# Altium project K10P100最小系统V1.0.PrjPCB
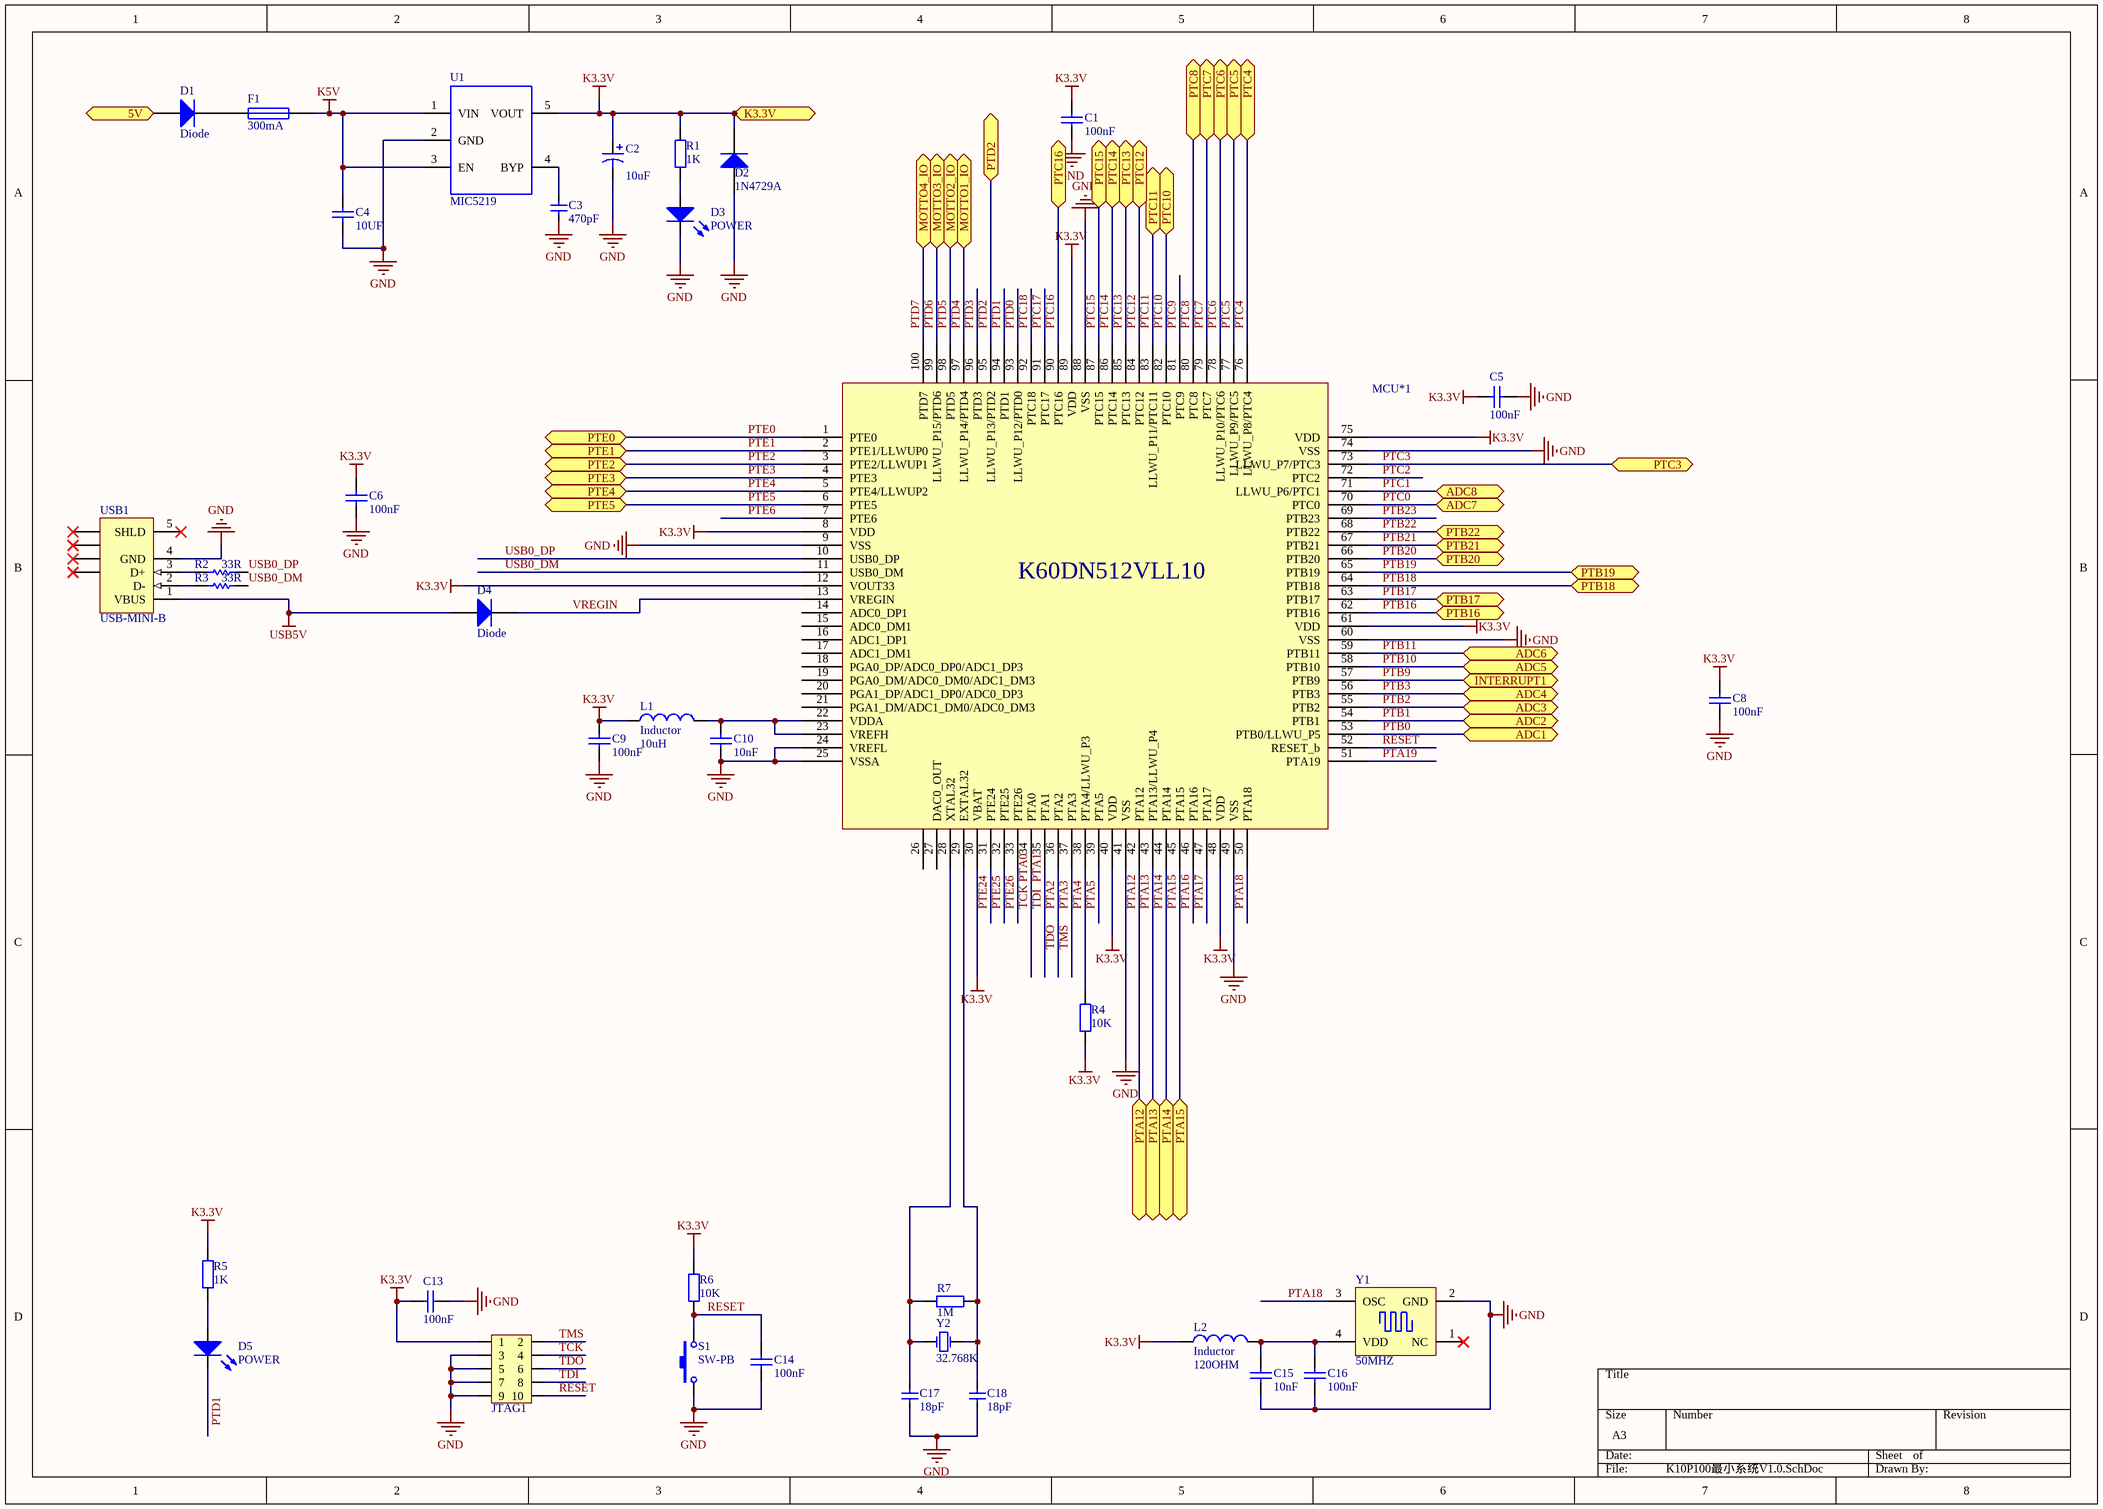
[diagram p0: K10P100最小系统V1.0.SchDoc]
4 sheets, 129 parts. Net scope: flat (ports and power ports of the same name join across sheets).
Board file: K10P100最小系统V1.0.PcbDoc
Sheets:
  K10P100最小系统V1.0.SchDoc
  电机驱动.SchDoc
  其他外设.SchDoc
  电源.SchDoc

## Sheet K10P100最小系统V1.0.SchDoc
size A3

### Parts
C1  100nF  [C2012]
C2  value 10uF  [C2012]  (hidden comment: Cap Pol1)
C3  470pF  [C2012]
C4  10UF  [C2012]
C5  100nF  [C2012]
C6  100nF  [C2012]
C8  100nF  [C2012]
C9  100nF  [C2012]
C10  10nF  [C2012]
C13  100nF  [C2012]
C14  100nF  [C2012]
C15  10nF  [C2012]
C16  100nF  [C2012]
C17  18pF  [C2012]
C18  18pF  [C2012]
D1  Diode  [1206(2)]
D2  1N4729A  [C2012]
D3  POWER  [C2012]
D4  Diode  [1206(2)]
D5  POWER  [C2012]
F1  300mA  [R2012]
JTAG1  Header 5X2  [IDC5X2]  (value not drawn)
L1  Inductor  value 10uH  [C2012]
L2  Inductor  value 120OHM  [C2012]
MCU*1  k60P100  [LQFP100]  (value not drawn)
R1  1K  [R2012]
R2  33R  [R2012]
R3  33R  [R2012]
R4  10K  [R2012]
R5  1K  [R2012]
R6  10K  [R2012]
R7  1M  [R2012]
S1  SW-PB  [sw 3*4 *2]
U1  MIC5219  [SOT-23-5]
USB1  USB-MINI-B  [USB-MINI-B]
Y1  50MHZ  [XTAL7_3225]
Y2  32.768K  [CT3215]

### Ports
5V, ADC1, ADC2, ADC3, ADC4, ADC5, ADC6, ADC7, ADC8, INTERRUPT1, K3.3V, MOTTO1_IO, MOTTO2_IO, MOTTO3_IO, MOTTO4_IO, PTA12, PTA13, PTA14, PTA15, PTB16, PTB17, PTB18, PTB19, PTB20, PTB21, PTB22, PTC3, PTC4, PTC5, PTC6, PTC7, PTC8, PTC10, PTC11, PTC12, PTC13, PTC14, PTC15, PTC16, PTD2, PTE0, PTE1, PTE2, PTE3, PTE4, PTE5

### Nets
5V: D1.1(A) ; port 5V
GND: C1.1 C2.2 C3.1 C4.1 C5.1 C6.1 C8.1 C9.1 C10.1 C13.2 C14.1 C15.1 C16.1 C17.1 C18.1 D2.1(A) D3.2 JTAG1.3 JTAG1.5 JTAG1.7 JTAG1.9 MCU*1.9(VSS) MCU*1.24(VREFL) MCU*1.25(VSSA) MCU*1.41(VSS) MCU*1.49(VSS) MCU*1.60(VSS) MCU*1.74(VSS) MCU*1.88(VSS) S1.1 U1.2(GND) USB1.4(GND) Y1.2(GND)
K3.3V: C1.2 C2.1 C5.2 C6.2 C8.2 C9.2 C13.1 D2.2(K) JTAG1.1 L1.1 L2.1 MCU*1.8(VDD) MCU*1.12(VOUT33) MCU*1.30(VBAT) MCU*1.40(VDD) MCU*1.48(VDD) MCU*1.61(VDD) MCU*1.75(VDD) MCU*1.89(VDD) R1.2 R4.1 R5.2 R6.2 U1.5(VOUT) ; port K3.3V
K5V: C4.2 F1.1 U1.1(VIN) U1.3(EN)
USB5V: D4.1(A) USB1.1(VBUS)
PTA0: JTAG1.4 MCU*1.34(PTA0)  [also labelled TCK]
PTA1: JTAG1.8 MCU*1.35(PTA1)  [also labelled TDI]
PTA2: JTAG1.6 MCU*1.36(PTA2)  [also labelled TDO]
PTA3: JTAG1.2 MCU*1.37(PTA3)  [also labelled TMS]
PTA4: MCU*1.38(PTA4/LLWU_P3) R4.2
PTA5: MCU*1.39(PTA5)
PTA12: MCU*1.42(PTA12) ; port PTA12
PTA13: MCU*1.43(PTA13/LLWU_P4) ; port PTA13
PTA14: MCU*1.44(PTA14) ; port PTA14  [project net BT RXD]
PTA15: MCU*1.45(PTA15) ; port PTA15  [project net BT TXD]
PTA16: MCU*1.46(PTA16)
PTA17: MCU*1.47(PTA17)
PTA18: MCU*1.50(PTA18) Y1.3(OSC)
PTA19: MCU*1.51(PTA19)
PTB0: MCU*1.53(PTB0/LLWU_P5) ; port ADC1
PTB1: MCU*1.54(PTB1) ; port ADC2
PTB2: MCU*1.55(PTB2) ; port ADC3
PTB3: MCU*1.56(PTB3) ; port ADC4
PTB9: MCU*1.57(PTB9) ; port INTERRUPT1
PTB10: MCU*1.58(PTB10) ; port ADC5
PTB11: MCU*1.59(PTB11) ; port ADC6
PTB16: MCU*1.62(PTB16) ; port PTB16  [project net OLEDCLK]
PTB17: MCU*1.63(PTB17) ; port PTB17  [project net OLEDMISO]
PTB18: MCU*1.64(PTB18) ; port PTB18
PTB19: MCU*1.65(PTB19) ; port PTB19
PTB20: MCU*1.66(PTB20) ; port PTB20  [project net OLEDRST]
PTB21: MCU*1.67(PTB21) ; port PTB21  [project net OLEDDC]
PTB22: MCU*1.68(PTB22) ; port PTB22  [project net OLEDCS]
PTB23: MCU*1.69(PTB23)
PTC0: MCU*1.70(PTC0) ; port ADC7
PTC1: MCU*1.71(LLWU_P6/PTC1) ; port ADC8
PTC2: MCU*1.72(PTC2)
PTC3: MCU*1.73(LLWU_P7/PTC3) ; port PTC3  [project net CE]
PTC4: MCU*1.76(LLWU_P8/PTC4) ; port PTC4  [project net PCS0]
PTC5: MCU*1.77(LLWU_P9/PTC5) ; port PTC5
PTC6: MCU*1.78(LLWU_P10/PTC6) ; port PTC6  [project net MOSI]
PTC7: MCU*1.79(PTC7) ; port PTC7  [project net MISO]
PTC8: MCU*1.80(PTC8) ; port PTC8  [project net IRQ]
PTC9: MCU*1.81(PTC9)
PTC10: MCU*1.82(PTC10) ; port PTC10
PTC11: MCU*1.83(LLWU_P11/PTC11) ; port PTC11
PTC12: MCU*1.84(PTC12) ; port PTC12  [project net Key5]
PTC13: MCU*1.85(PTC13) ; port PTC13  [project net Key4]
PTC14: MCU*1.86(PTC14) ; port PTC14  [project net Key3]
PTC15: MCU*1.87(PTC15) ; port PTC15  [project net Key2]
PTC16: MCU*1.90(PTC16) ; port PTC16  [project net Key1]
PTC17: MCU*1.91(PTC17)
PTC18: MCU*1.92(PTC18)
PTD0: MCU*1.93(LLWU_P12/PTD0)
PTD1: D5.2 MCU*1.94(PTD1)
PTD2: MCU*1.95(LLWU_P13/PTD2) ; port PTD2
PTD3: MCU*1.96(PTD3)
PTD4: MCU*1.97(LLWU_P14/PTD4) ; port MOTTO1_IO
PTD5: MCU*1.98(PTD5) ; port MOTTO2_IO
PTD6: MCU*1.99(LLWU_P15/PTD6) ; port MOTTO3_IO
PTD7: MCU*1.100(PTD7) ; port MOTTO4_IO
PTE0: MCU*1.1(PTE0) ; port PTE0
PTE1: MCU*1.2(PTE1/LLWUP0) ; port PTE1
PTE2: MCU*1.3(PTE2/LLWUP1) ; port PTE2
PTE3: MCU*1.4(PTE3) ; port PTE3
PTE4: MCU*1.5(PTE4/LLWUP2) ; port PTE4
PTE5: MCU*1.6(PTE5) ; port PTE5
PTE6: MCU*1.7(PTE6)
PTE24: MCU*1.31(PTE24)
PTE25: MCU*1.32(PTE25)
PTE26: MCU*1.33(PTE26)
RESET: C14.2 JTAG1.10 MCU*1.52(RESET_b) R6.1 S1.2
USB0_DM: MCU*1.11(USB0_DM) R3.2
USB0_DP: MCU*1.10(USB0_DP) R2.2
VREGIN: D4.2(K) MCU*1.13(VREGIN)
NetC3_2: C3.2 U1.4(BYP)
NetC10_2: C10.2 L1.2 MCU*1.22(VDDA) MCU*1.23(VREFH)
NetC15_2: C15.2 C16.2 L2.2 Y1.4(VDD)
NetC17_2: C17.2 MCU*1.28(XTAL32) R7.1 Y2.1(OSC1)
NetC18_2: C18.2 MCU*1.29(EXTAL32) R7.2 Y2.2(OSC2)
NetD1_2: D1.2(K) F1.2
NetD3_1: D3.1 R1.1
NetD5_1: D5.1 R5.1
NetR2_1: R2.1 USB1.3(D+)
NetR3_1: R3.1 USB1.2(D-)

Not connected (* = marked no-connect by the designer): MCU*1 14(ADC0_DP1) 15(ADC0_DM1) 16(ADC1_DP1) 17(ADC1_DM1) 18(PGA0_DP/ADC0_DP0/ADC1_DP3) 19(PGA0_DM/ADC0_DM0/ADC1_DM3) 20(PGA1_DP/ADC1_DP0/ADC0_DP3) 21(PGA1_DM/ADC1_DM0/ADC0_DM3) 26(VREF_OUT/CMP1_IN5CMP0_IN5/ADC1_SE18) 27(DAC0_OUT); USB1 5(SHLD)* 6(SHLD)* 7(SHLD)* 8(SHLD)* 9(SHLD)*; Y1 1(NC)*

### Notes on the sheet
- (in symbol k60P100) K60DN512VLL10

### Library data of the parts
C1 C4-C6 C8-C10 C13-C16 = Cap: Capacitor
C2 = Cap Pol1: Polarized Capacitor (Radial); Published: 8-Jun-2000; LatestRevisionDate: 17-Jul-2002; LatestRevisionNote: Re-released for DXP Platform.; PackageReference: RB7.6-15; Publisher: Altium Limited; PackageDescription: Polarized Capacitor (Radial); 2 Leads
C3 C17 C18 = 陶瓷电容: CAP
D1 D4 = Diode: Default Diode; Published: 8-Jun-2000; LatestRevisionDate: 17-Jul-2002; LatestRevisionNote: Re-released for DXP Platform.; PackageVersion: Sep-1996; PackageReference: SMC; Publisher: Altium Limited; PackageDescription: DO-214-AB/SMC; 2 C-Bend Leads; Body 7.9 x 5.9 mm, inc. leads (LxW); Code_JEDEC: DO-214-AB
D2 = Diode 1N4148: High Conductance Fast Diode; LatestRevisionDate: 17-Jul-2002; LatestRevisionNote: Re-released for DXP Platform.; DatasheetDocument: 1997; PackageReference: DO-35; Publisher: Altium Limited; Code_JEDEC: DO-204-AH; ComponentLink1Description: Manufacturer Link; ComponentLink2Description: Datasheet; ComponentLink2URL: http://www.fairchildsemi.com/ds/1N%2F1N4148.pdf
D3 D5 = LED: Typical INFRARED GaAs LED
F1 = Fuse 1: Fuse; Published: 8-Jun-2000; LatestRevisionDate: 17-Jul-2002; LatestRevisionNote: Re-released for DXP Platform.; PackageReference: PIN-W2/E2.8; Publisher: Altium Limited
JTAG1 = Header 5X2: Header, 5-Pin, Dual row
L1 L2 = Inductor: Code_IEC: 1005; Published: 8-Jun-2000; LatestRevisionDate: 29-May-2009; LatestRevisionNote: IPC-7351 Footprint Added.; PackageReference: 0402-A; Publisher: Altium Limited; PackageDescription: Chip Inductor; Code_JEITA: 0402
R1 R4 R5 = Res: Resistor of led
R2 R3 = Res: 贴片电阻; Value: 1K; Published: 8-Jun-2000; LatestRevisionDate: 17-Jul-2002; LatestRevisionNote: Re-released for DXP Platform.; PackageReference: AXIAL-0.3; Publisher: Altium Limited
R6 R7 = Res: Resistor
S1 = SW-PB: Switch
U1 = MIC5219: LDO
USB1 = USB-MINI-B: USB 2.0, Right Angle, SMT, A Type, Receptacle, 5 Position, Black; ContactMaterial: Phosphor Bronze; ContactPlating: Gold (30) over Nickel; PCB_Layout: Complies with manufacturer's recommendation.; DrillSize: Corresponds to nominal value.; PanelGround: Without; Published: 15-Jul-2004; DatasheetDocument: 15-Nov-2002; PackageDocument: 15-Nov-2002; PackageReference: 440478; Publisher: Altium Limited; HousingMaterial: Thermoplastic; ComponentLink1Description: Manufacturer Link; ComponentLink1URL: http://www.tycoelectronics.com/; ComponentLink2Description: Packaging Specification; ComponentLink2URL: http://ecommas.tycoelectronics.com/commerce/DocumentDelivery/DDEController?Action=showdoc&DocId=Customer+Drawing%7F440478%7FB%7Fpdf%7FEnglish%7FC_440478_B.pdf
Y1 = XTAL1
Y2 = XTAL: Crystal Oscillator

## Sheet 电机驱动.SchDoc
size A3
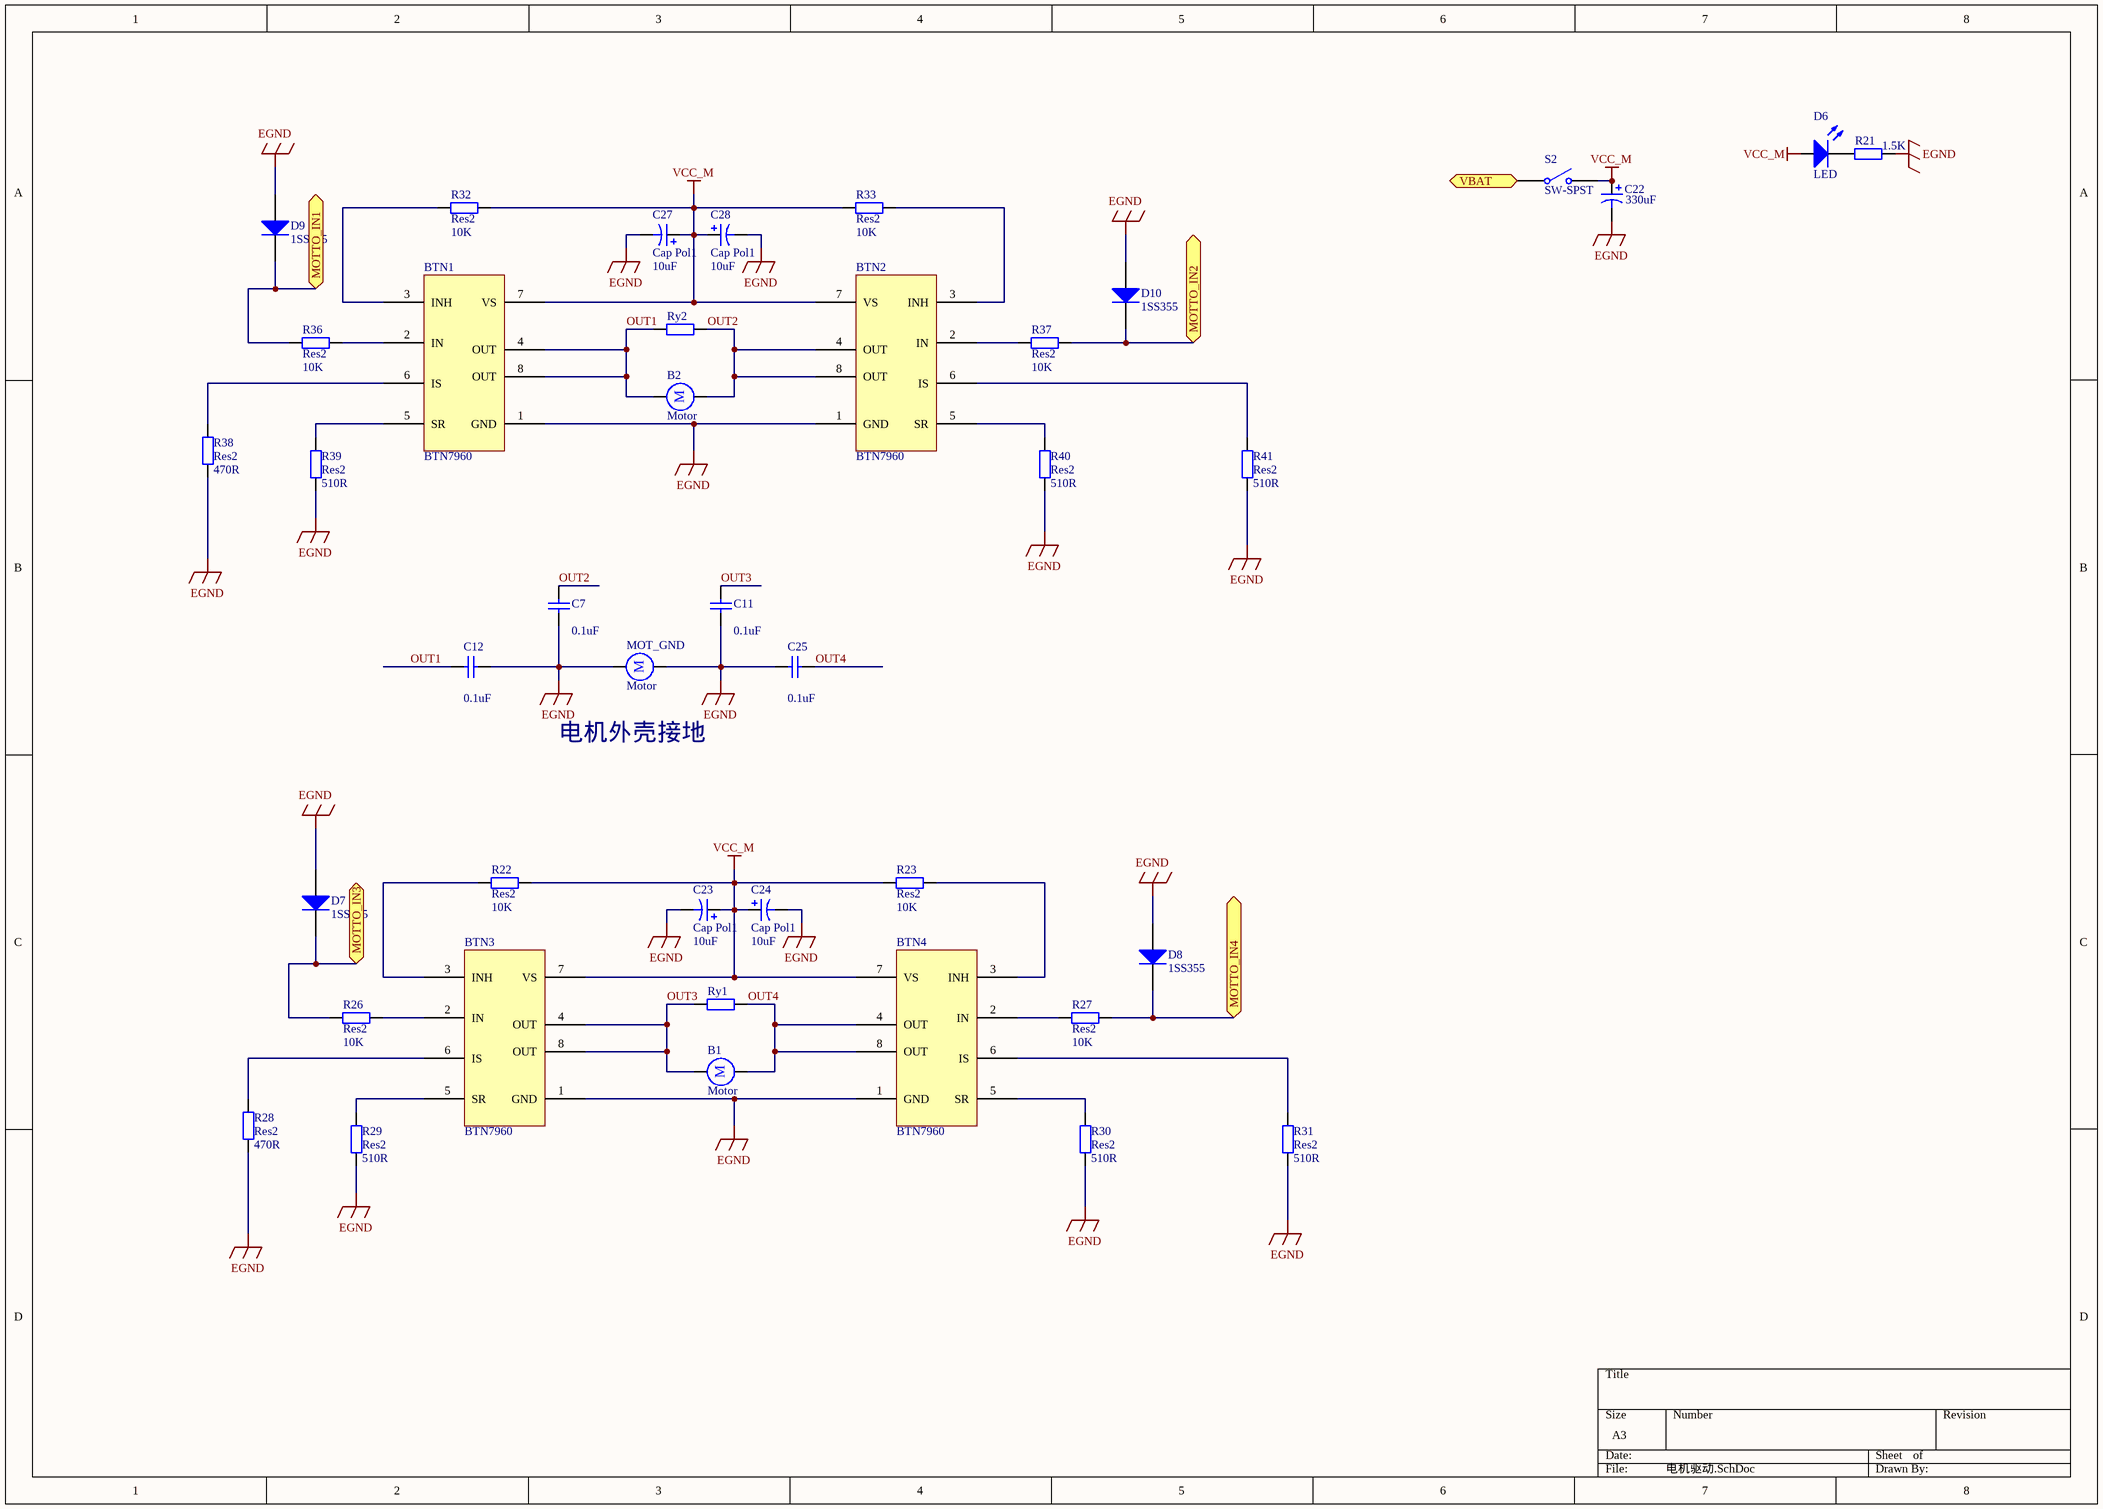
[diagram p1: 电机驱动.SchDoc]

### Parts
B1  Motor  [KF301-2P]
B2  Motor  [KF301-2P]
BTN1  BTN7960  [PG-TO263-7-1]
BTN2  BTN7960  [PG-TO263-7-1]
BTN3  BTN7960  [PG-TO263-7-1]
BTN4  BTN7960  [PG-TO263-7-1]
C7  value 0.1uF  [C2012]  (hidden comment: Cap)
C11  value 0.1uF  [C2012]  (hidden comment: Cap)
C12  value 0.1uF  [C2012]  (hidden comment: Cap)
C22  value 330uF  [SMD-EC-F8]  (hidden comment: Cap Pol1)
C23  Cap Pol1  value 10uF  [1206(2)]
C24  Cap Pol1  value 10uF  [1206(2)]
C25  value 0.1uF  [C2012]  (hidden comment: Cap)
C27  Cap Pol1  value 10uF  [1206(2)]
C28  Cap Pol1  value 10uF  [1206(2)]
D6  LED  [C2012]
D7  1SS355  [1206(2)]
D8  1SS355  [1206(2)]
D9  1SS355  [1206(2)]
D10  1SS355  [1206(2)]
MOT_GND  Motor  [KF301-2P]
R21  value 1.5K  [R2012]  (hidden comment: Res2)
R22  Res2  value 10K  [R2012]
R23  Res2  value 10K  [R2012]
R26  Res2  value 10K  [R2012]
R27  Res2  value 10K  [R2012]
R28  Res2  value 470R  [R2012]
R29  Res2  value 510R  [R2012]
R30  Res2  value 510R  [R2012]
R31  Res2  value 510R  [R2012]
R32  Res2  value 10K  [R2012]
R33  Res2  value 10K  [R2012]
R36  Res2  value 10K  [R2012]
R37  Res2  value 10K  [R2012]
R38  Res2  value 470R  [R2012]
R39  Res2  value 510R  [R2012]
R40  Res2  value 510R  [R2012]
R41  Res2  value 510R  [R2012]
Ry1  (no value)  [1206(2)]
Ry2  (no value)  [1206(2)]
S2  SW-SPST  [SW-125V6A(-)]

### Ports
MOTTO_IN1, MOTTO_IN2, MOTTO_IN3, MOTTO_IN4, VBAT

### Nets
EGND: BTN1.1(GND) BTN2.1(GND) BTN3.1(GND) BTN4.1(GND) C7.2 C11.2 C12.2 C22.2 C23.2 C24.2 C25.1 C27.2 C28.2 D7.1(A) D8.1(A) D9.1(A) D10.1(A) MOT_GND.1 MOT_GND.2 R21.1 R28.1 R29.1 R30.1 R31.1 R38.1 R39.1 R40.1 R41.1
VBAT: S2.1(COMMON) ; port VBAT
VCC_M: BTN1.7(VS) BTN2.7(VS) BTN3.7(VS) BTN4.7(VS) C22.1 C23.1 C24.1 C27.1 C28.1 D6.1 R22.2 R23.1 R32.2 R33.1 S2.2(NO)
OUT1: B2.1 BTN1.4(OUT) BTN1.8(OUT) C12.1 Ry2.1
OUT2: B2.2 BTN2.4(OUT) BTN2.8(OUT) C7.1 Ry2.2
OUT3: B1.1 BTN3.4(OUT) BTN3.8(OUT) C11.1 Ry1.1
OUT4: B1.2 BTN4.4(OUT) BTN4.8(OUT) C25.2 Ry1.2
NetBTN1_2: BTN1.2(IN) R36.2
NetBTN1_3: BTN1.3(INH) R32.1
NetBTN1_5: BTN1.5(SR) R39.2
NetBTN1_6: BTN1.6(IS) R38.2
NetBTN2_2: BTN2.2(IN) R37.1
NetBTN2_3: BTN2.3(INH) R33.2
NetBTN2_5: BTN2.5(SR) R40.2
NetBTN2_6: BTN2.6(IS) R41.2
NetBTN3_2: BTN3.2(IN) R26.2
NetBTN3_3: BTN3.3(INH) R22.1
NetBTN3_5: BTN3.5(SR) R29.2
NetBTN3_6: BTN3.6(IS) R28.2
NetBTN4_2: BTN4.2(IN) R27.1
NetBTN4_3: BTN4.3(INH) R23.2
NetBTN4_5: BTN4.5(SR) R30.2
NetBTN4_6: BTN4.6(IS) R31.2
NetD6_2: D6.2 R21.2
NetD7_2: D7.2(K) R26.1 ; port MOTTO_IN3
NetD8_2: D8.2(K) R27.2 ; port MOTTO_IN4
NetD9_2: D9.2(K) R36.1 ; port MOTTO_IN1
NetD10_2: D10.2(K) R37.2 ; port MOTTO_IN2

### Notes on the sheet
- 电机外壳接地
- (in symbol Motor) M

### Library data of the parts
B1 B2 MOT_GND = Motor: Motor, General Kind
C7 C11 C12 C25 = Cap: Capacitor; Published: 8-Jun-2000; LatestRevisionDate: 17-Jul-2002; LatestRevisionNote: Re-released for DXP Platform.; PackageReference: RAD-0.3; Publisher: Altium Limited; PackageDescription: Radial Cap, Thru-Hole; 2 Leads; 0.3 in Pin Spacing
C22-C24 C27 C28 = Cap Pol1: Polarized Capacitor (Radial); Published: 8-Jun-2000; LatestRevisionDate: 17-Jul-2002; LatestRevisionNote: Re-released for DXP Platform.; PackageReference: RB7.6-15; Publisher: Altium Limited; PackageDescription: Polarized Capacitor (Radial); 2 Leads
D6 = LED: Typical INFRARED GaAs LED
D7-D10 = Diode 1N4148: High Conductance Fast Diode; LatestRevisionDate: 17-Jul-2002; LatestRevisionNote: Re-released for DXP Platform.; DatasheetDocument: 1997; PackageReference: DO-35; Publisher: Altium Limited; Code_JEDEC: DO-204-AH; ComponentLink1Description: Manufacturer Link; ComponentLink2Description: Datasheet; ComponentLink2URL: http://www.fairchildsemi.com/ds/1N%2F1N4148.pdf
R21-R23 R26-R33 R36-R41 = Res2: Resistor; Published: 8-Jun-2000; LatestRevisionDate: 17-Jul-2002; LatestRevisionNote: Re-released for DXP Platform.; PackageReference: AXIAL-0.4; Publisher: Altium Limited; PackageDescription: Axial Device, Thru-Hole; 2 Leads; 0.4 in Pin Spacing
Ry1 Ry2 = Res: Resistor
S2 = SW-SPST: Single-Pole, Single-Throw Switch; Published: 24-Mar-1999; LatestRevisionDate: 17-Jul-2002; LatestRevisionNote: Re-released for DXP Platform.; PackageReference: SPST-2; Publisher: Altium Limited; PackageDescription: Switch; 2 Leads

## Sheet 其他外设.SchDoc
size A3
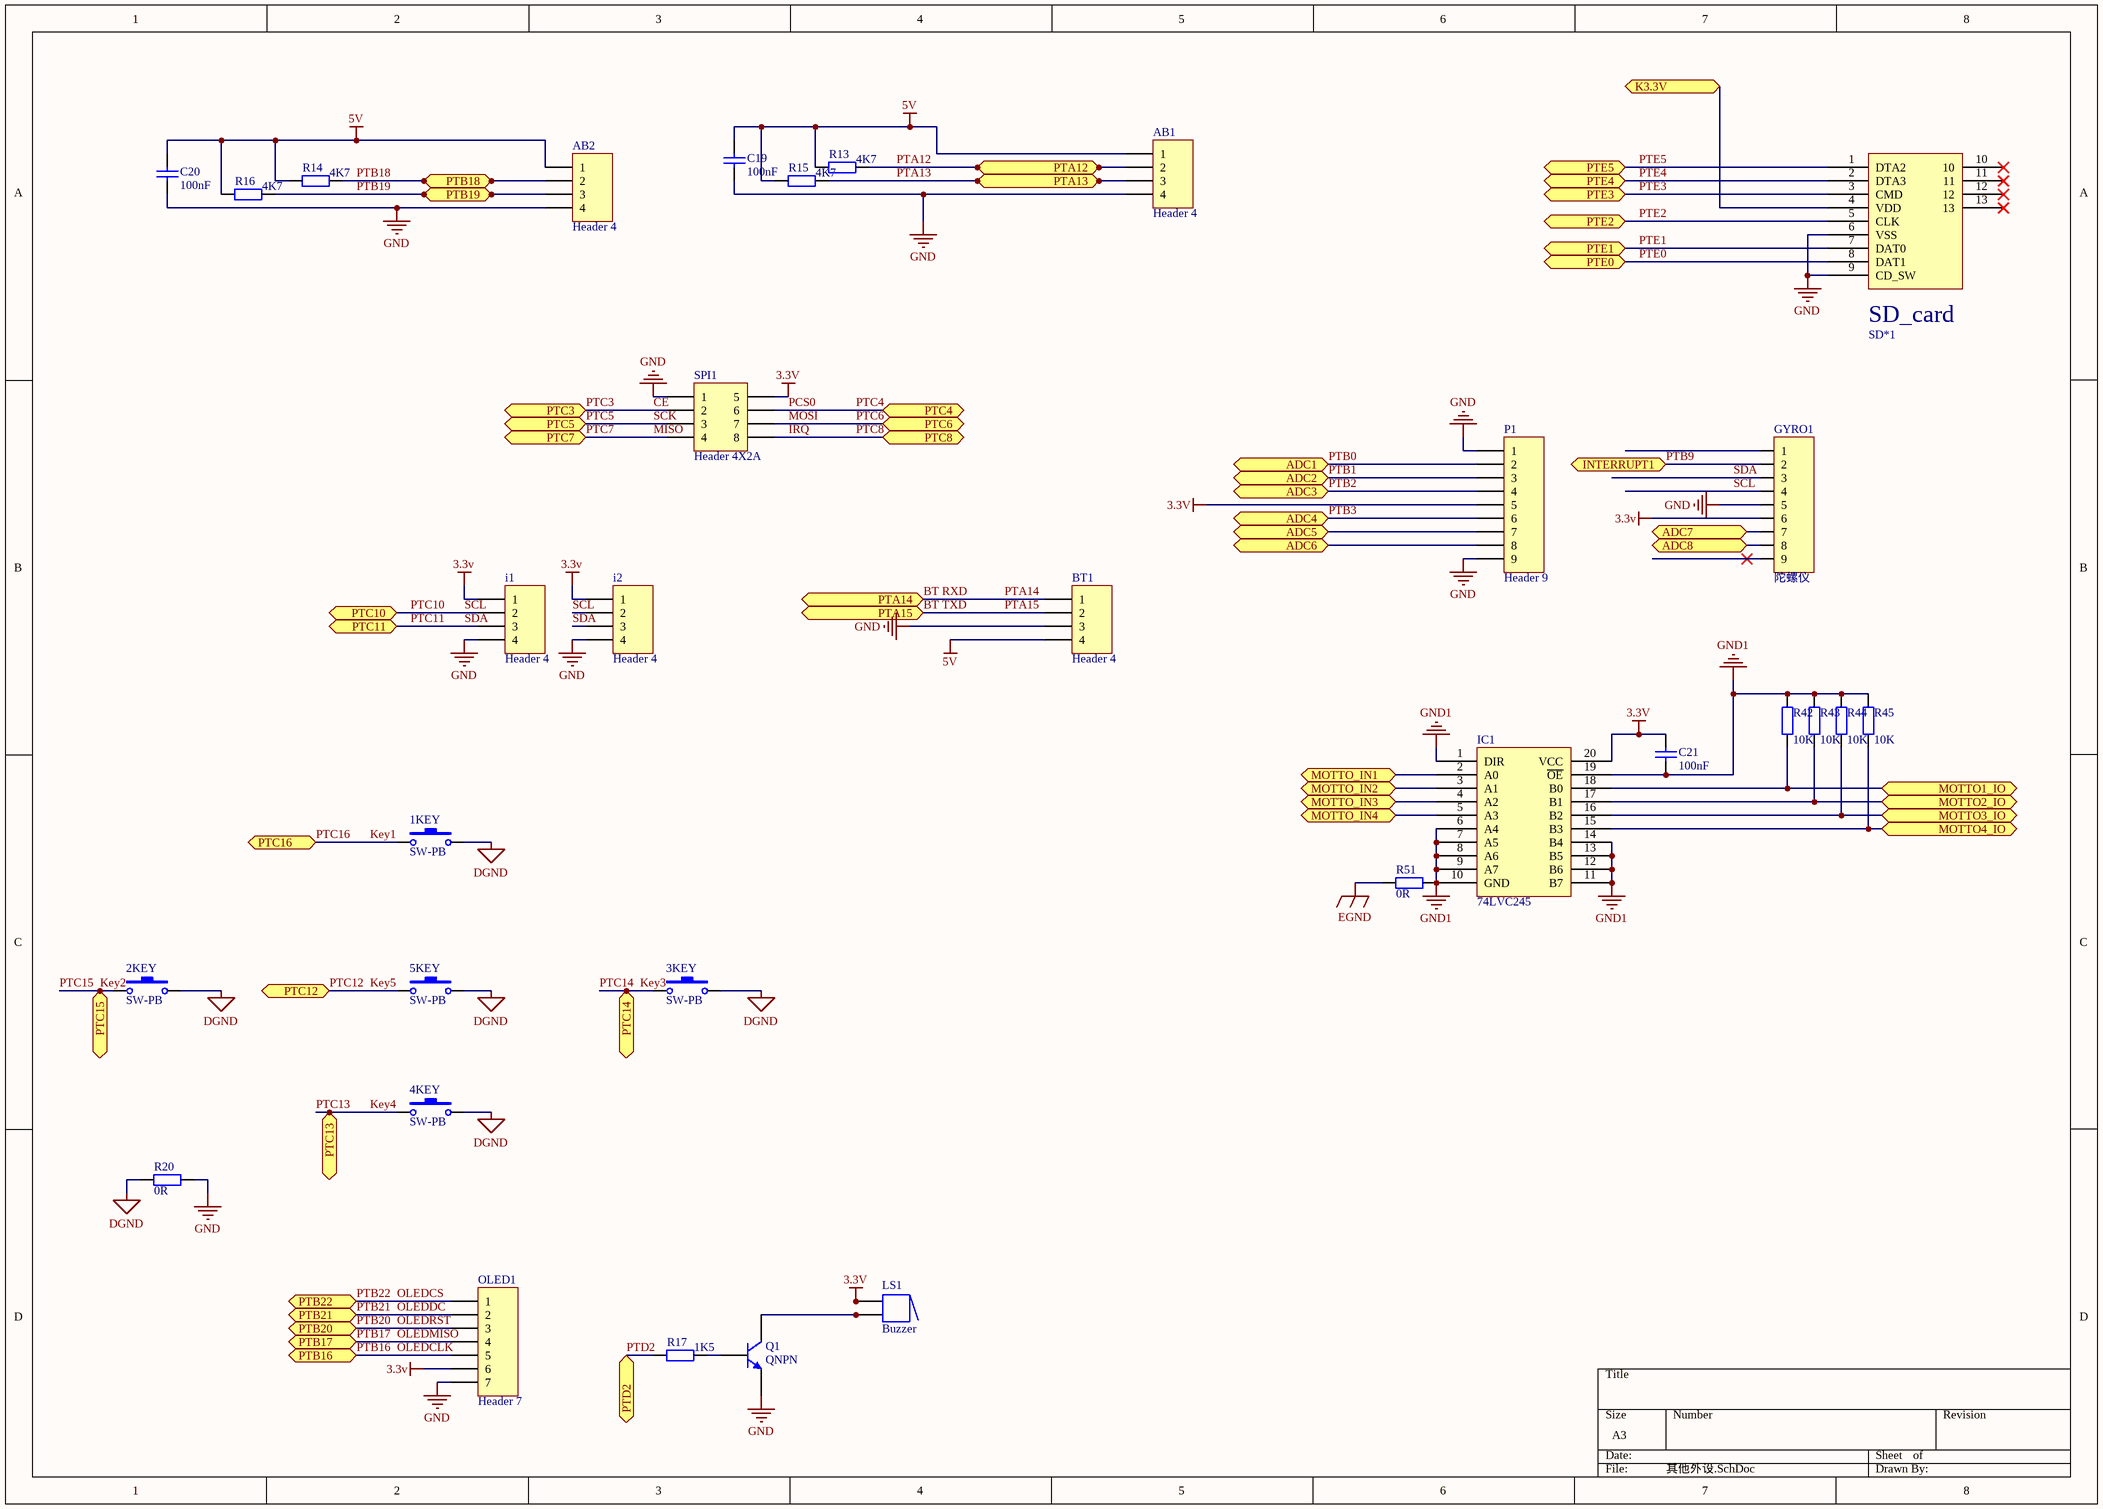
[diagram p2: 其他外设.SchDoc]

### Parts
1KEY  SW-PB  [sw 3*4 *2]
2KEY  SW-PB  [sw 3*4 *2]
3KEY  SW-PB  [sw 3*4 *2]
4KEY  SW-PB  [sw 3*4 *2]
5KEY  SW-PB  [sw 3*4 *2]
AB1  Header 4  [HDR1X4]
AB2  Header 4  [HDR1X4]
BT1  Header 4  [HDR1X4]
C19  100nF  [C2012]
C20  100nF  [C2012]
C21  100nF  [C2012]
GYRO1  陀螺仪  [landzo_AngularRate_Accelerometer_Sensor]
i1  Header 4  [HDR1X4]
i2  Header 4  [HDR1X4]
IC1  74LVC245  [TSSOP20 74lvc245]
LS1  Buzzer  [ABSM-1574]
OLED1  Header 7  [HDR1X7]
P1  Header 9  [HDR1X9]
Q1  QNPN  [SOT95P240-3N]
R13  value 4K7  [R2012]  (hidden comment: Res2)
R14  value 4K7  [R2012]  (hidden comment: Res2)
R15  value 4K7  [R2012]  (hidden comment: Res2)
R16  value 4K7  [R2012]  (hidden comment: Res2)
R17  value 1K5  [R2012]  (hidden comment: Res2)
R20  0R  [R2012]
R42  value 10K  [R2012]  (hidden comment: Res2)
R43  value 10K  [R2012]  (hidden comment: Res2)
R44  value 10K  [R2012]  (hidden comment: Res2)
R45  value 10K  [R2012]  (hidden comment: Res2)
R51  value 0R  [1206(2)]  (hidden comment: Res2)
SD*1  TF_card  [SD_card]  (value not drawn)
SPI1  Header 4X2A  [SMT head4*1]

### Ports
ADC1, ADC2, ADC3, ADC4, ADC5, ADC6, ADC7, ADC8, INTERRUPT1, K3.3V, MOTTO1_IO, MOTTO2_IO, MOTTO3_IO, MOTTO4_IO, MOTTO_IN1, MOTTO_IN2, MOTTO_IN3, MOTTO_IN4, PTA12, PTA13, PTA14, PTA15, PTB16, PTB17, PTB18, PTB19, PTB20, PTB21, PTB22, PTC3, PTC4, PTC5, PTC6, PTC7, PTC8, PTC10, PTC11, PTC12, PTC13, PTC14, PTC15, PTC16, PTD2, PTE0, PTE1, PTE2, PTE3, PTE4, PTE5

### Nets
3.3v: C21.1 GYRO1.6 i1.1 i2.1 IC1.20(VCC) LS1.1 LS1.1A OLED1.6 P1.5 SPI1.5
5V: AB1.1 AB2.1 BT1.4 C19.1 C20.1 R13.2 R14.2 R15.2 R16.2
DGND: 1KEY.2 2KEY.2 3KEY.2 4KEY.2 5KEY.2 R20.2
EGND: R51.1
GND: AB1.4 AB2.4 BT1.3 C19.2 C20.2 GYRO1.5 i1.4 i2.4 OLED1.7 P1.1 P1.9 Q1.3(E) R20.1 SD*1.6(VSS) SD*1.9(CD_SW) SPI1.1
GND1: C21.2 IC1.1(DIR) IC1.6(A4) IC1.7(A5) IC1.8(A6) IC1.9(A7) IC1.10(GND) IC1.11(B7) IC1.12(B6) IC1.13(B5) IC1.14(B4) IC1.19(~{OE}) R42.2 R43.2 R44.2 R45.2 R51.2
K3.3V: SD*1.4(VDD) ; port K3.3V
BT RXD: BT1.1 ; port PTA14  [also labelled PTA14]
BT TXD: BT1.2 ; port PTA15  [also labelled PTA15]
CE: SPI1.2 ; port PTC3  [also labelled PTC3]
IRQ: SPI1.8 ; port PTC8  [also labelled PTC8]
Key1: 1KEY.1 ; port PTC16  [also labelled PTC16]
Key2: 2KEY.1 ; port PTC15  [also labelled PTC15]
Key3: 3KEY.1 ; port PTC14  [also labelled PTC14]
Key4: 4KEY.1 ; port PTC13  [also labelled PTC13]
Key5: 5KEY.1 ; port PTC12  [also labelled PTC12]
MISO: SPI1.4 ; port PTC7  [also labelled PTC7]
MOSI: SPI1.7 ; port PTC6  [also labelled PTC6]
OLEDCLK: OLED1.5 ; port PTB16  [also labelled PTB16]
OLEDCS: OLED1.1 ; port PTB22  [also labelled PTB22]
OLEDDC: OLED1.2 ; port PTB21  [also labelled PTB21]
OLEDMISO: OLED1.4 ; port PTB17  [also labelled PTB17]
OLEDRST: OLED1.3 ; port PTB20  [also labelled PTB20]
PCS0: SPI1.6 ; port PTC4  [also labelled PTC4]
PTA12: AB1.2 R13.1 ; port PTA12
PTA13: AB1.3 R15.1 ; port PTA13
PTB0: P1.2 ; port ADC1
PTB1: P1.3 ; port ADC2
PTB2: P1.4 ; port ADC3
PTB3: P1.6 ; port ADC4
PTB9: GYRO1.2 ; port INTERRUPT1
PTB10: P1.7 ; port ADC5
PTB11: P1.8 ; port ADC6
PTB18: AB2.2 R14.1 ; port PTB18
PTB19: AB2.3 R16.1 ; port PTB19
PTC0: GYRO1.7 ; port ADC7
PTC1: GYRO1.8 ; port ADC8
PTC5: SPI1.3 ; port PTC5  [also labelled SCK]
PTC10: GYRO1.4 i1.2 i2.2 ; port PTC10  [also labelled SCL]
PTC11: GYRO1.3 i1.3 i2.3 ; port PTC11  [also labelled SDA]
PTD2: R17.2 ; port PTD2
PTD4: IC1.18(B0) R42.1 ; port MOTTO1_IO
PTD5: IC1.17(B1) R43.1 ; port MOTTO2_IO
PTD6: IC1.16(B2) R44.1 ; port MOTTO3_IO
PTD7: IC1.15(B3) R45.1 ; port MOTTO4_IO
PTE0: SD*1.8(DAT1) ; port PTE0
PTE1: SD*1.7(DAT0) ; port PTE1
PTE2: SD*1.5(CLK) ; port PTE2
PTE3: SD*1.3(CMD) ; port PTE3
PTE4: SD*1.2(DTA3) ; port PTE4
PTE5: SD*1.1(DTA2) ; port PTE5
NetD7_2: IC1.4(A2) ; port MOTTO_IN3
NetD8_2: IC1.5(A3) ; port MOTTO_IN4
NetD9_2: IC1.2(A0) ; port MOTTO_IN1
NetD10_2: IC1.3(A1) ; port MOTTO_IN2
NetLS1_2: LS1.2 LS1.2A Q1.1(C)
NetQ1_2: Q1.2(B) R17.1

Not connected (* = marked no-connect by the designer): GYRO1 1 9*; SD*1 10* 11* 12* 13*

### Notes on the sheet
- (in symbol TF_card) SD_card

### Library data of the parts
1KEY 2KEY 3KEY 4KEY 5KEY = SW-PB: Switch
AB1 AB2 BT1 i1 i2 = Header 4: Header, 4-Pin; LatestRevisionDate: 17-Jul-2002; LatestRevisionNote: Re-released for DXP Platform.; Publisher: Altium Limited
C19-C21 = Cap: Capacitor
GYRO1 = Header 9: Header, 8-Pin
LS1 = Buzzer: Magnetic Transducer Buzzer; pin to pad: 1>1A 2>2A; Published: 24-Mar-1999; LatestRevisionDate: 17-Dec-2003; LatestRevisionNote: Schematic revised, PCB Footprint replaced.; DatasheetVersion: 17-Dec-2003; PackageReference: ABSM-1574; Publisher: Altium Limited; ComponentLink1Description: Manufacturer Link; ComponentLink1URL: http://www.megastar.com/linecard/buzzmode/index.php
OLED1 = Header 7: Header, 7-Pin; LatestRevisionDate: 17-Jul-2002; LatestRevisionNote: Re-released for DXP Platform.; Publisher: Altium Limited
P1 = Header 9: Header, 9-Pin; LatestRevisionDate: 17-Jul-2002; LatestRevisionNote: Re-released for DXP Platform.; Publisher: Altium Limited
Q1 = QNPN: NPN Bipolar Transistor; pin to pad: 1>3 2>1 3>2; Published: 8-Jun-2000; LatestRevisionDate: 29-May-2009; LatestRevisionNote: IPC-7351 Footprint Added.; PackageVersion: Aug-1999; PackageReference: SOT-23B; Publisher: Altium Limited; PackageDescription: 3-Pin SOT-23 Package 0.95 mm Pitch, 2.4 mm Lead Span
R13-R17 R42-R45 R51 = Res2: Resistor; Published: 8-Jun-2000; LatestRevisionDate: 17-Jul-2002; LatestRevisionNote: Re-released for DXP Platform.; PackageReference: AXIAL-0.4; Publisher: Altium Limited; PackageDescription: Axial Device, Thru-Hole; 2 Leads; 0.4 in Pin Spacing
R20 = Res: Resistor of led
SPI1 = Header 4X2A: Header, 4-Pin, Dual row; LatestRevisionDate: 17-Jul-2002; LatestRevisionNote: Re-released for DXP Platform.; Publisher: Altium Limited

## Sheet 电源.SchDoc
size A3
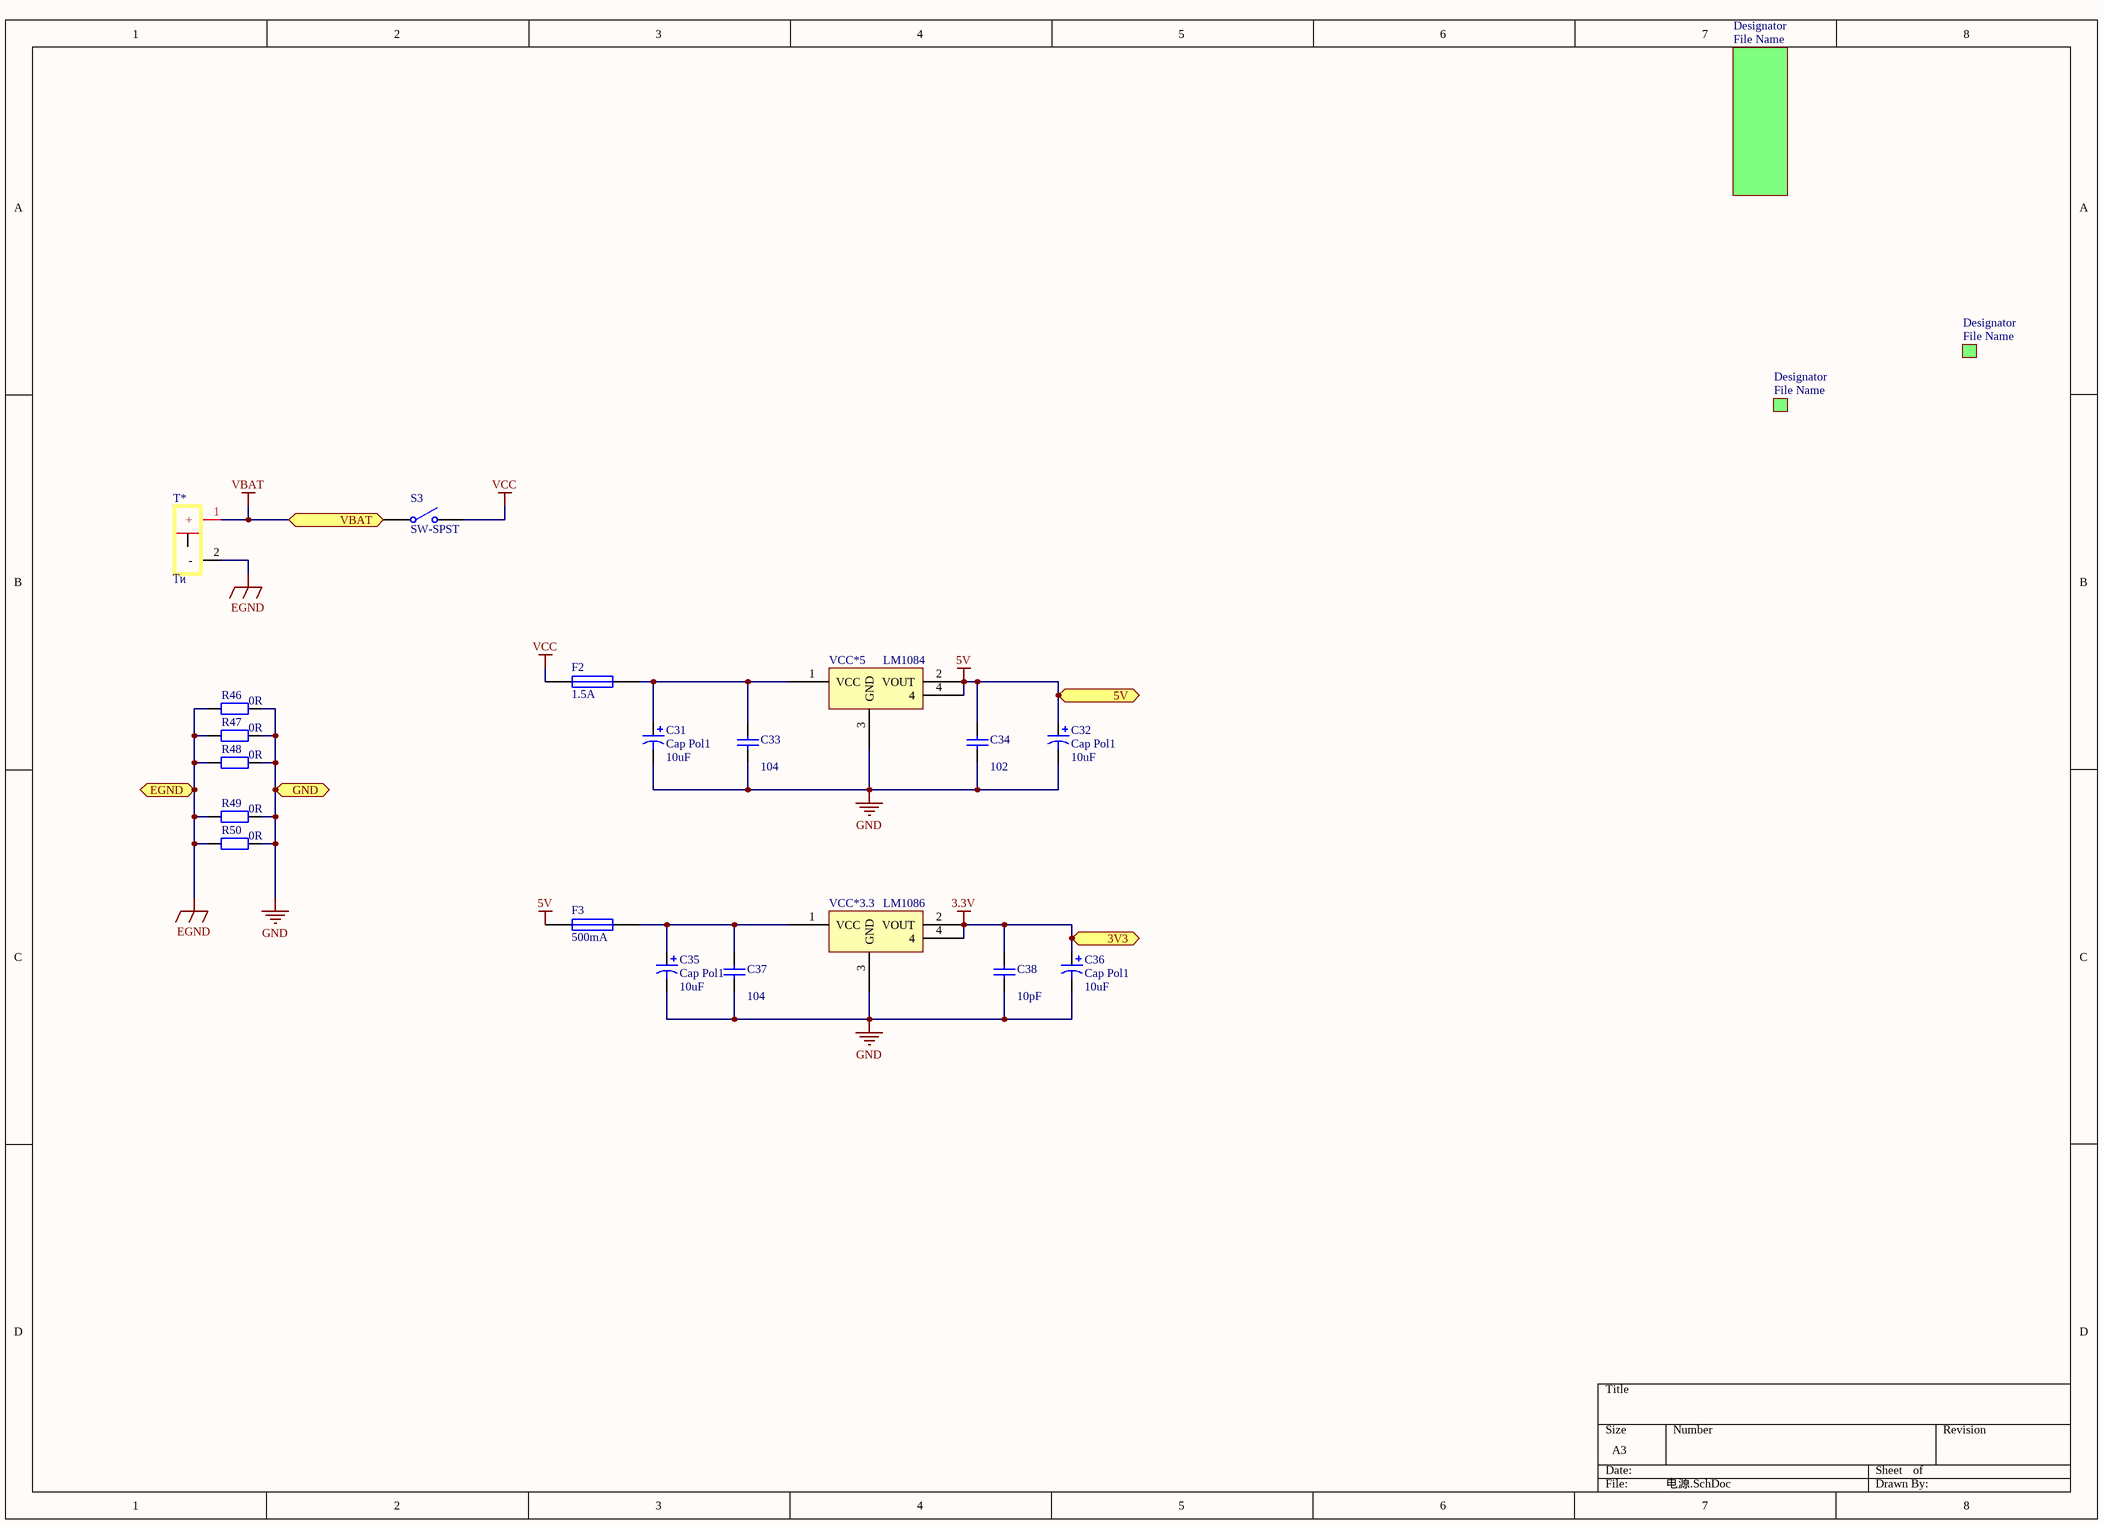
[diagram p3: 电源.SchDoc]

### Parts
C31  Cap Pol1  value 10uF  [1206(2)]
C32  Cap Pol1  value 10uF  [1206(2)]
C33  value 104  [C2012]  (hidden comment: Cap)
C34  value 102  [C2012]  (hidden comment: Cap)
C35  Cap Pol1  value 10uF  [1206(2)]
C36  Cap Pol1  value 10uF  [1206(2)]
C37  value 104  [C2012]  (hidden comment: Cap)
C38  value 10pF  [C2012]  (hidden comment: Cap)
F2  1.5A  [1206(2)]
F3  500mA  [1206(2)]
R46  value 0R  [1206(2)]  (hidden comment: Res2)
R47  value 0R  [1206(2)]  (hidden comment: Res2)
R48  value 0R  [1206(2)]  (hidden comment: Res2)
R49  value 0R  [1206(2)]  (hidden comment: Res2)
R50  value 0R  [1206(2)]  (hidden comment: Res2)
S3  SW-SPST  [SW-125V6A(-)]
T*  Tͷ  [T插]
VCC*3.3  LM1086  [DPAK LM2940]
VCC*5  LM1084  [DPAK LM2940]

### Sub-sheets
Designator = File Name (file not in this document): no entries
Designator = File Name (file not in this document): no entries
Designator = File Name (file not in this document): no entries

### Ports
3V3, 5V, EGND, GND, VBAT

### Nets
3.3v: C36.1 C38.2 VCC*3.3.2(VOUT) VCC*3.3.4 ; port 3V3
5V: C32.1 C34.2 F3.1 VCC*5.2(VOUT) VCC*5.4 ; port 5V
EGND: R46.2 R47.2 R48.2 R49.2 R50.2 T*.2(-) ; port EGND
GND: C31.2 C32.2 C33.1 C34.1 C35.2 C36.2 C37.1 C38.1 R46.1 R47.1 R48.1 R49.1 R50.1 VCC*3.3.3(GND) VCC*5.3(GND) ; port GND
VBAT: S3.1(COMMON) T*.1(+) ; port VBAT
VCC: F2.1 S3.2(NO)
NetC31_1: C31.1 C33.2 F2.2 VCC*5.1(VCC)
NetC35_1: C35.1 C37.2 F3.2 VCC*3.3.1(VCC)

### Library data of the parts
C31 C32 C35 C36 = Cap Pol1: Polarized Capacitor (Radial); Published: 8-Jun-2000; LatestRevisionDate: 17-Jul-2002; LatestRevisionNote: Re-released for DXP Platform.; PackageReference: RB7.6-15; Publisher: Altium Limited; PackageDescription: Polarized Capacitor (Radial); 2 Leads
C33 C34 C37 C38 = Cap: 贴片电容; Published: 8-Jun-2000; LatestRevisionDate: 17-Jul-2002; LatestRevisionNote: Re-released for DXP Platform.; PackageReference: RAD-0.3; Publisher: Altium Limited
F2 F3 = Fuse 1: Fuse; Published: 8-Jun-2000; LatestRevisionDate: 17-Jul-2002; LatestRevisionNote: Re-released for DXP Platform.; PackageReference: PIN-W2/E2.8; Publisher: Altium Limited
R46-R50 = Res2: Resistor; Published: 8-Jun-2000; LatestRevisionDate: 17-Jul-2002; LatestRevisionNote: Re-released for DXP Platform.; PackageReference: AXIAL-0.4; Publisher: Altium Limited; PackageDescription: Axial Device, Thru-Hole; 2 Leads; 0.4 in Pin Spacing
S3 = SW-SPST: Single-Pole, Single-Throw Switch; Published: 24-Mar-1999; LatestRevisionDate: 17-Jul-2002; LatestRevisionNote: Re-released for DXP Platform.; PackageReference: SPST-2; Publisher: Altium Limited
VCC*3.3 VCC*5 = LM1086: pin to pad: 1>3 3>1

## Nets that join several sheets
3.3v: 其他外设 (10 pins), 电源 (C36.1 C38.2 VCC*3.3.2 VCC*3.3.4)
5V: K10P100最小系统V1.0 (D1.1), 其他外设 (9 pins), 电源 (5 pins)
EGND: 电机驱动 (28 pins), 其他外设 (R51.1), 电源 (6 pins)
GND: K10P100最小系统V1.0 (33 pins), 其他外设 (16 pins), 电源 (15 pins)
K3.3V: K10P100最小系统V1.0 (24 pins), 其他外设 (SD*1.4)
VBAT: 电机驱动 (S2.1), 电源 (S3.1 T*.1)
BT RXD: K10P100最小系统V1.0 (MCU*1.44), 其他外设 (BT1.1)
BT TXD: K10P100最小系统V1.0 (MCU*1.45), 其他外设 (BT1.2)
CE: K10P100最小系统V1.0 (MCU*1.73), 其他外设 (SPI1.2)
IRQ: K10P100最小系统V1.0 (MCU*1.80), 其他外设 (SPI1.8)
Key1: K10P100最小系统V1.0 (MCU*1.90), 其他外设 (1KEY.1)
Key2: K10P100最小系统V1.0 (MCU*1.87), 其他外设 (2KEY.1)
Key3: K10P100最小系统V1.0 (MCU*1.86), 其他外设 (3KEY.1)
Key4: K10P100最小系统V1.0 (MCU*1.85), 其他外设 (4KEY.1)
Key5: K10P100最小系统V1.0 (MCU*1.84), 其他外设 (5KEY.1)
MISO: K10P100最小系统V1.0 (MCU*1.79), 其他外设 (SPI1.4)
MOSI: K10P100最小系统V1.0 (MCU*1.78), 其他外设 (SPI1.7)
NetD7_2: 电机驱动 (D7.2 R26.1), 其他外设 (IC1.4)
NetD8_2: 电机驱动 (D8.2 R27.2), 其他外设 (IC1.5)
NetD9_2: 电机驱动 (D9.2 R36.1), 其他外设 (IC1.2)
NetD10_2: 电机驱动 (D10.2 R37.2), 其他外设 (IC1.3)
OLEDCLK: K10P100最小系统V1.0 (MCU*1.62), 其他外设 (OLED1.5)
OLEDCS: K10P100最小系统V1.0 (MCU*1.68), 其他外设 (OLED1.1)
OLEDDC: K10P100最小系统V1.0 (MCU*1.67), 其他外设 (OLED1.2)
OLEDMISO: K10P100最小系统V1.0 (MCU*1.63), 其他外设 (OLED1.4)
OLEDRST: K10P100最小系统V1.0 (MCU*1.66), 其他外设 (OLED1.3)
PCS0: K10P100最小系统V1.0 (MCU*1.76), 其他外设 (SPI1.6)
PTA12: K10P100最小系统V1.0 (MCU*1.42), 其他外设 (AB1.2 R13.1)
PTA13: K10P100最小系统V1.0 (MCU*1.43), 其他外设 (AB1.3 R15.1)
PTB0: K10P100最小系统V1.0 (MCU*1.53), 其他外设 (P1.2)
PTB1: K10P100最小系统V1.0 (MCU*1.54), 其他外设 (P1.3)
PTB2: K10P100最小系统V1.0 (MCU*1.55), 其他外设 (P1.4)
PTB3: K10P100最小系统V1.0 (MCU*1.56), 其他外设 (P1.6)
PTB9: K10P100最小系统V1.0 (MCU*1.57), 其他外设 (GYRO1.2)
PTB10: K10P100最小系统V1.0 (MCU*1.58), 其他外设 (P1.7)
PTB11: K10P100最小系统V1.0 (MCU*1.59), 其他外设 (P1.8)
PTB18: K10P100最小系统V1.0 (MCU*1.64), 其他外设 (AB2.2 R14.1)
PTB19: K10P100最小系统V1.0 (MCU*1.65), 其他外设 (AB2.3 R16.1)
PTC0: K10P100最小系统V1.0 (MCU*1.70), 其他外设 (GYRO1.7)
PTC1: K10P100最小系统V1.0 (MCU*1.71), 其他外设 (GYRO1.8)
PTC5: K10P100最小系统V1.0 (MCU*1.77), 其他外设 (SPI1.3)
PTC10: K10P100最小系统V1.0 (MCU*1.82), 其他外设 (GYRO1.4 i1.2 i2.2)
PTC11: K10P100最小系统V1.0 (MCU*1.83), 其他外设 (GYRO1.3 i1.3 i2.3)
PTD2: K10P100最小系统V1.0 (MCU*1.95), 其他外设 (R17.2)
PTD4: K10P100最小系统V1.0 (MCU*1.97), 其他外设 (IC1.18 R42.1)
PTD5: K10P100最小系统V1.0 (MCU*1.98), 其他外设 (IC1.17 R43.1)
PTD6: K10P100最小系统V1.0 (MCU*1.99), 其他外设 (IC1.16 R44.1)
PTD7: K10P100最小系统V1.0 (MCU*1.100), 其他外设 (IC1.15 R45.1)
PTE0: K10P100最小系统V1.0 (MCU*1.1), 其他外设 (SD*1.8)
PTE1: K10P100最小系统V1.0 (MCU*1.2), 其他外设 (SD*1.7)
PTE2: K10P100最小系统V1.0 (MCU*1.3), 其他外设 (SD*1.5)
PTE3: K10P100最小系统V1.0 (MCU*1.4), 其他外设 (SD*1.3)
PTE4: K10P100最小系统V1.0 (MCU*1.5), 其他外设 (SD*1.2)
PTE5: K10P100最小系统V1.0 (MCU*1.6), 其他外设 (SD*1.1)